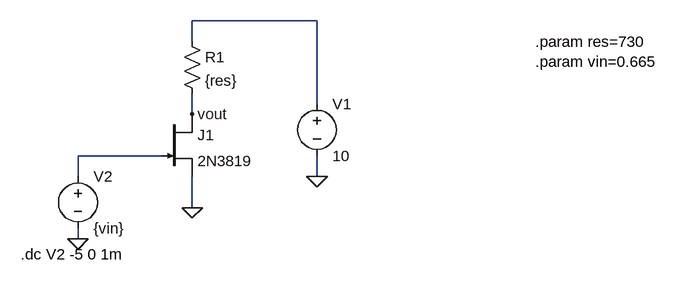
[diagram p0: schematic entradajfet.asc]
entradajfet.asc, the LTspice schematic file:
Version 4
SHEET 1 916 680
WIRE 352 -16 160 -16
WIRE 160 16 160 -16
WIRE 352 112 352 -16
WIRE 160 128 160 96
WIRE 112 192 -16 192
WIRE -16 224 -16 192
WIRE 352 224 352 192
WIRE 160 272 160 224
WIRE -16 320 -16 304
FLAG 160 272 0
FLAG -16 320 0
FLAG 352 224 0
FLAG 160 128 vout
SYMBOL njf 112 128 R0
SYMATTR InstName J1
SYMATTR Value 2N3819
SYMBOL res 144 0 R0
SYMATTR InstName R1
SYMATTR Value {res}
SYMBOL voltage 352 96 R0
WINDOW 123 0 0 Left 0
WINDOW 39 0 0 Left 0
SYMATTR InstName V1
SYMATTR Value 10
SYMBOL voltage -16 208 R0
WINDOW 123 0 0 Left 0
WINDOW 39 0 0 Left 0
SYMATTR InstName V2
SYMATTR Value {vin}
TEXT 688 16 Left 2 !.param res=730\n.param vin=0.665
TEXT -104 344 Left 2 !.dc V2 -5 0 1m

The netlist it stands for:
* entradajfet.asc
J1 vout N002 0 2N3819
R1 N001 vout {res}
V1 N001 0 10
V2 N002 0 {vin}
.model NJF NJF
.model PJF PJF
.lib standard.jft
.param res=730
.param vin=0.665
.dc V2 -5 0 1m
.backanno
.end